# Altium schematic sheet Leds.SchDoc
size A4; SheetNumber: 4; SheetTotal: 8
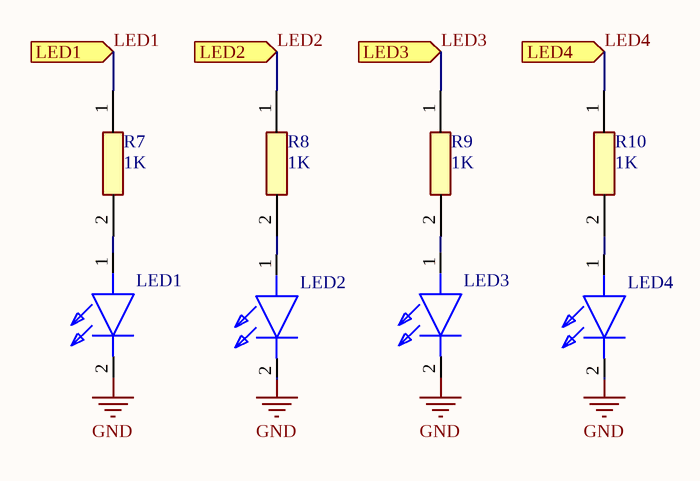
[diagram p0: Leds.SchDoc]

## Parts
LED1  APHCM2012SURCK-F01  [APHCM2012SURCKF01]  (value not drawn)
LED2  APHCM2012SURCK-F01  [APHCM2012SURCKF01]  (value not drawn)
LED3  APHCM2012SURCK-F01  [APHCM2012SURCKF01]  (value not drawn)
LED4  APHCM2012SURCK-F01  [APHCM2012SURCKF01]  (value not drawn)
R7  1K  [RESC3216X75N]
R8  1K  [RESC3216X75N]
R9  1K  [RESC3216X75N]
R10  1K  [RESC3216X75N]

## Ports
LED1 (in), LED2 (in), LED3 (in), LED4 (in)

## Nets
GND: LED1.2(K) LED2.2(K) LED3.2(K) LED4.2(K)
LED1: R7.1 ; port LED1
LED2: R8.1 ; port LED2
LED3: R9.1 ; port LED3
LED4: R10.1 ; port LED4
NetLED1_1: LED1.1(A) R7.2
NetLED2_1: LED2.1(A) R8.2
NetLED3_1: LED3.1(A) R9.2
NetLED4_1: LED4.1(A) R10.2

## Library data of the parts
LED1-LED4 = APHCM2012SURCK-F01: LED; Manufacturer_Name: Kingbright; Datasheet Link: https://componentsearchengine.com/Datasheets/1/APHCM2012SURCK-F01.pdf; Height: 0.5mm; Manufacturer_Part_Number: APHCM2012SURCK-F01; Mouser Part Number: 604-APHCM2012SURCK; Mouser Price/Stock: https://www.mouser.co.uk/ProductDetail/Kingbright/APHCM2012SURCK-F01?qs=qqKal61G0Kww4v8qUa%2Fyzg%3D%3D; Arrow Part Number: APHCM2012SURCK-F01; Arrow Price/Stock: https://www.arrow.com/en/products/aphcm2012surck-f01/kingbright?region=nac
R7-R10 = CR1206-F_-2R00ELF: Resistor; Manufacturer_Name: Bourns; Manufacturer_Part_Number: CR1206-F/-2R00ELF; Height: 0.75mm; Mouser Part Number: 652-CR1206-F/2R00ELF; Mouser Price/Stock: https://www.mouser.co.uk/ProductDetail/Bourns/CR1206-F-2R00ELF?qs=W%2FMpXkg%252BdQ47Z%2FeZv1nDSg%3D%3D